# Altium schematic sheet TopSheet.SchDoc
size A4; CompanyName: Technische Hochschule Nürnberg Georg Simon Ohm; Organization: UltraZohm; Address1: Kesslerplatz 12; Address2: 90489 Nürnberg; Address3: GERMANY; DocumentNumber: 1; SheetNumber: 1; SheetTotal: 2; Website: www.ultrazohm.com
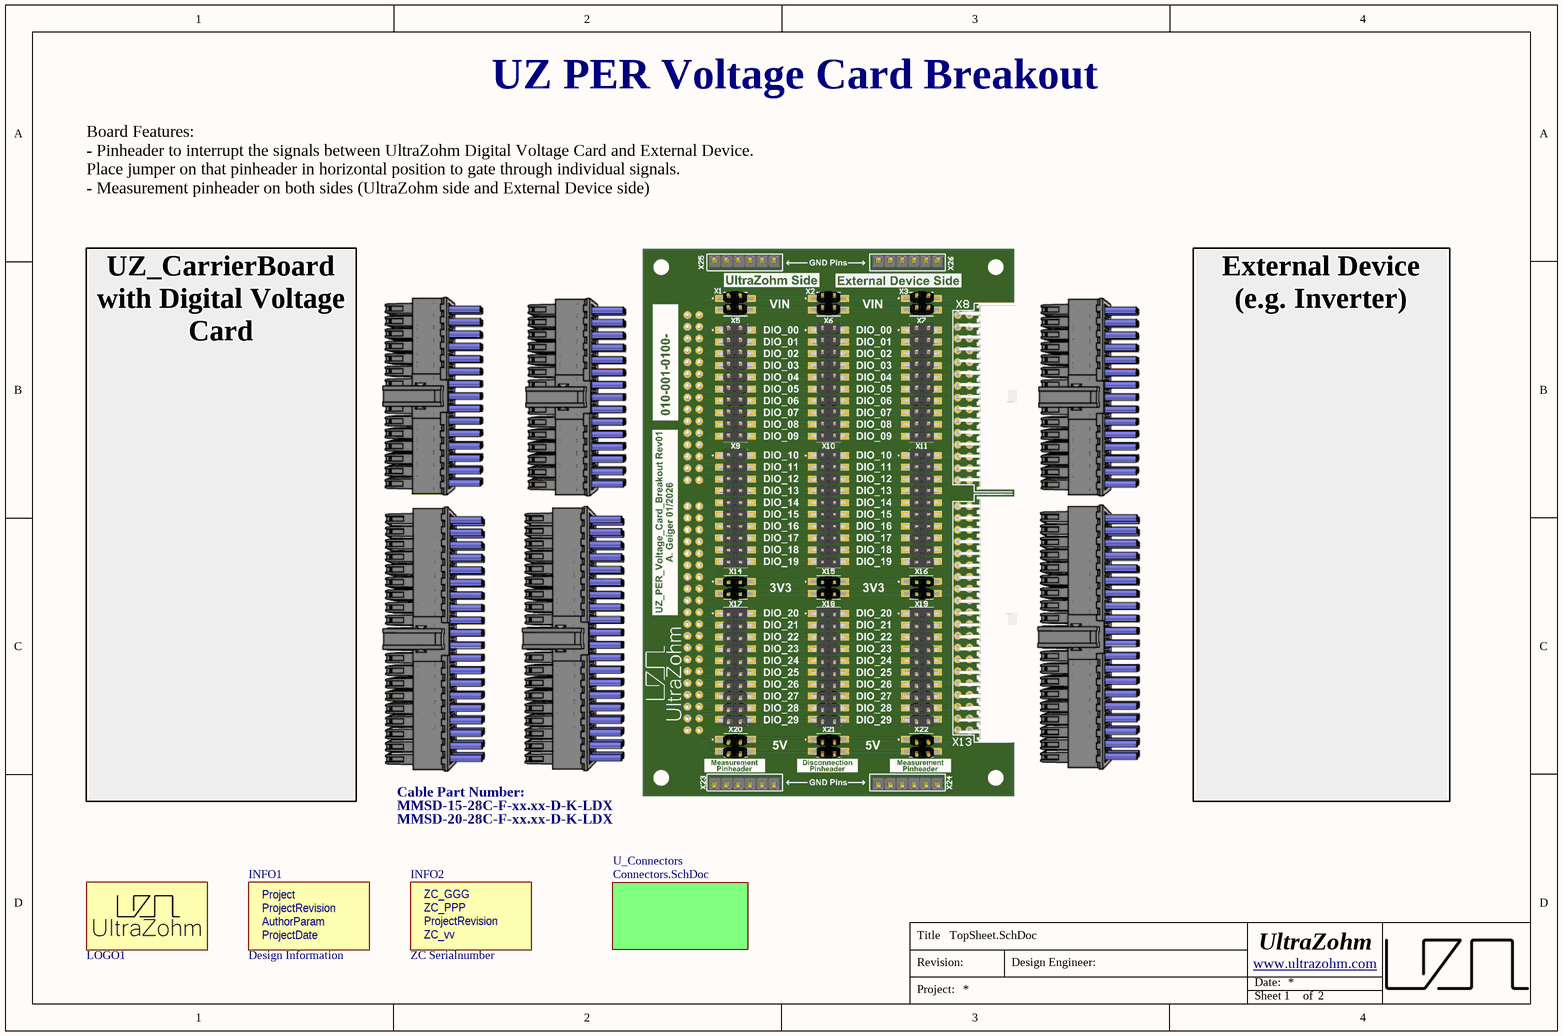
[diagram p0: TopSheet.SchDoc]

## Parts
INFO1  Design Information  [Design_info]  (no BOM)
INFO2  ZC Serialnumber  [ZC-Serial]  (no BOM)
LOGO1  UZ Logo  [UZ_Logo_tiny]  (value not drawn)  (no BOM)

## Sub-sheets
U_Connectors = Connectors.SchDoc: no entries

## Notes on the sheet
- UZ PER Voltage Card Breakout
- Board Features:
  - Pinheader to interrupt the signals between UltraZohm Digital Voltage Card and External Device. Place jumper on that pinheader in horizontal position to gate through individual signals.
  - Measurement pinheader on both sides (UltraZohm side and External Device side)
- UZ_CarrierBoard with Digital Voltage Card
- MMSD-15-28C-F-xx.xx-D-K-LDX
- MMSD-20-28C-F-xx.xx-D-K-LDX
- Cable Part Number:
- External Device
  (e.g. Inverter)
- Title
- Revision:
- Design Engineer:
- Date:
- Project:
- Sheet
- of
- (in symbol Design_info) Project; ProjectRevision; AuthorParam; ProjectDate
- (in symbol ZC-Serial) ZC_GGG; ZC_PPP; ProjectRevision; ZC_vv

## Library data of the parts
INFO1 = Design_info
INFO2 = ZC-Serial: Manufacturer: UltraZohm; Value: GGG-PPP-VVvv; Created from: FRosner; Manufacturer Part Number: ZC-Serial; PartID: 58; Created On: 15.04.2025 09:17:14; ComponentLink1Description: https://docs.ultrazohm.com/; ComponentLink1URL: homepage; Component Type: ZC Serialnumber; Last Updated: 15.04.2025 09:17:14; Supplier 1: -; Supplier Part Number 1: -; Type: Serial Number; Live Cycle Status: 1
LOGO1 = 1: Official Project Logo of the UltraZohm; Manufacturer: PCB Manufacturer; Manufacturer Part Number: UltraZohm Logo; Created from: T. Wendt; PartID: 1; Created On: 19.02.2021 16:55:56; ComponentLink1Description: Homepage; ComponentLink1URL: https://ultrazohm.com; Component Type: Logo; Last Updated: 02.03.2021 14:31:24; Type: Standard (No BOM); Live Cycle Status: 1